# Altium schematic sheet comutator.SchDoc: =DocumentName
size A4; CompanyName: "AS Manufacturing" LLC; Organization: "AS Manufacturing" LLC; Address1: 5 Sklyarenka St.; Address2: Kyiv 04073; Address3: Ukraine; Address4: https://ajax.systems/en/; DocumentNumber: 4; SheetNumber: 4; SheetTotal: 7; Template_version: 1.0.1
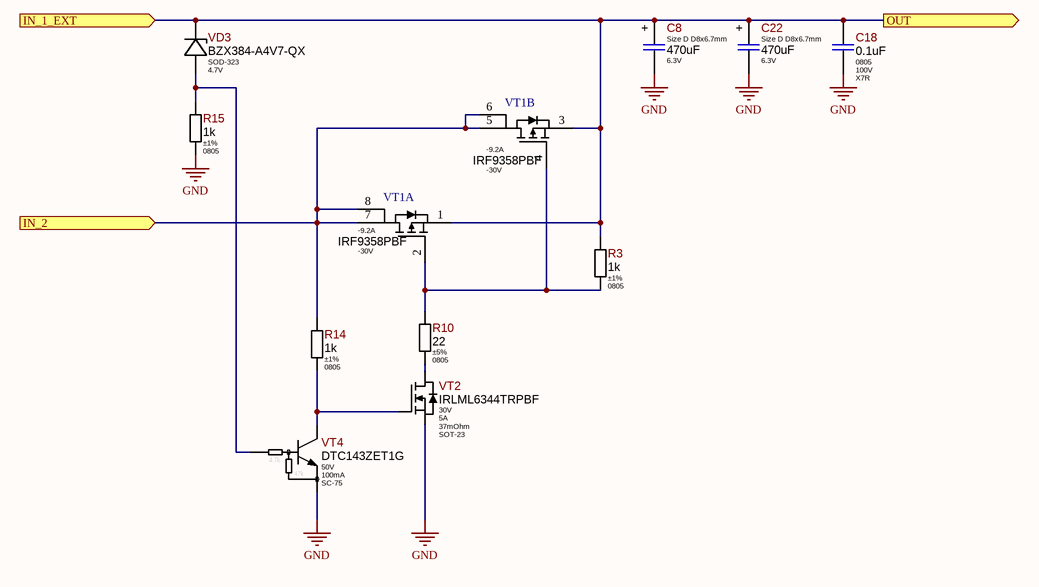
[diagram p0: comutator.SchDoc]

## Parts
C8  value 470uF  Package: Size D D8x6.7mm  Voltage: 6.3V  [CAP-AE-830x670H30_MED]  (hidden comment: 470uFx6.3V)
C18  Package: 0805  Voltage: 100V  Dielectric Type: X7R  [C_CERAMIC_0805_MED]  (hidden comment: 0.1uF)
C22  value 470uF  Package: Size D D8x6.7mm  Voltage: 6.3V  [CAP-AE-830x670H30_MED]  (hidden comment: 470uFx6.3V)
R3  Tolerance: ±1%  Package: 0805  [R_ANY_CHIP_0805_MED]  (hidden comment: 1k)
R10  Tolerance: ±5%  Package: 0805  [R_ANY_CHIP_0805_MED]  (hidden comment: 22)
R14  Tolerance: ±1%  Package: 0805  [R_ANY_CHIP_0805_MED]  (hidden comment: 1k)
R15  Tolerance: ±1%  Package: 0805  [R_ANY_CHIP_0805_MED]  (hidden comment: 1k)
VD3  Package: SOD-323  Voltage: 4.7V  [SOD-323_MED]  (hidden comment: BZX384-A4V7-QX)
VT1  Continuous Drain Current: -9.2A  Drain To Source Voltage: -30V  [FP-PG-DSO-8-IPC_B]  (hidden comment: IRF9358PBF)  (parts A,B of 2)
VT2  Vds: 30V  Id: 5A  Rds: 37mOhm  Package: SOT-23  [SOT-23_MED]  (hidden comment: IRLML6344)
VT4  Vce: 50V  Ic: 100mA  Package: SC-75  [SOT-416]  (hidden comment: DTC143ZET1G)

## Ports
IN_1_EXT (in), IN_2 (in), OUT (out)

## Nets
GND: C8.2 C18.2 C22.2 R15.2 VT2.2(S) VT4.2(E)
IN_1_EXT: C8.1 C18.1 C22.1 R3.1 VD3.CA VT1.1(S2) VT1.3(S1) ; port IN_1_EXT, port OUT
IN_2: R14.1 VT1.5(D12) VT1.6(D11) VT1.7(D22) VT1.8(D21) ; port IN_2
NetR3_2: R3.2 R10.1 VT1.2(G2) VT1.4(G1)
NetR10_2: R10.2 VT2.3(D)
NetR14_2: R14.2 VT2.1(G) VT4.3(C)
NetR15_1: R15.1 VD3.AN VT4.1(B)

## Notes on the sheet
- Title
- Product:
- Project:
- Size:
- Date:
- Variant:
- A4
- Authors:
- Time:
- Sheet
- of
- Revision:
- @Vitech_ua
- Commit:
- (in symbol DTC143ZET1G) 4.7k; 47k
- (in symbol RHA0J471MCN1GS) +

## Library data of the parts
C8 C22 = RHA0J471MCN1GS: 470uF 6.3V ±20% Size D D8x6.7mm SMD Low ESR Aluminum Electrolytic Capacitor, 9mOhm, 4.5A Ripple Current, 2000 Hrs @ 105°C; Manufacturer: Nichicon; Ajax_1C_ID: 47814; Ajax_1C_PN: 470uF 6.3V 20% 8x7.6mm RHA0J471MCN1GS Nichicon Aluminium Capacitors; Ajax_1С_Status: Mass Production; Standard Lead Time: 17 Weeks; Component Status: Released; Dielectric Type: NONE; GUID_1C: ebb9074e-17d1-11ed-a362-005056994834; Part Number: RHA0J471MCN1GS; Part Type: Aluminum; Component Type: SMD; Temperature Range: -55°C ~ 105°C; Tolerance: ±20%; ComponentLink1URL: https://eu.mouser.com/datasheet/2/293/e_rhs_rha-2507346.pdf; Supplier 1: Mouser; Supplier Part Number 1: 647-RHA0J471MCN1GS; Replacement: NONE; Price: 0,23717112; ComponentLink1Description: Datasheet
C18 = CL21B104KCFSFNE: 100nF 100V X7R ±10% 0805 Ceramic Capacitor RoHS; Manufacturer: Samsung Electro-Mechanics; Ajax_1C_ID: 12279; Ajax_1C_PN: 100nF 100V X7R 10% 0805 CL21B104KCFSFNE Ceramic Capacitor SMD RoHS; Ajax_1С_Status: Mass Production; Standard Lead Time: 22 Weeks; Component Status: Released; Replacement: NONE; GUID_1C: e54cb00c-325f-11e8-822c-14dda9d2d04d; Value: 0.1uF; Part Number: CL21B104KCFSFNE; Part Type: Ceramic / X7R / 0805; Component Type: SMD; Temperature Range: -55°C ~ 125°C; Tolerance: ±10%; ComponentLink1URL: https://media.digikey.com/pdf/Data%20Sheets/Samsung%20PDFs/CL_Series_MLCC_ds.pdf; Supplier 1: Digi-Key; Supplier Part Number 1: 1276-2923-2-ND; Price: 0,0054; ComponentLink1Description: Datasheet
R3 R14 R15 = RC0805FR-072K2L: 2.2 kOhms ±1% 1/8W 0805 Thick Film Resistor; Manufacturer: Yageo; Ajax_1C_ID: 30906; Ajax_1C_PN: 2.2k 1% 0805 Resistors SMD RoHS; Ajax_1С_Status: RND Only; Power Rating: 0.125W; Voltage: 150V; Component Status: Released; Temperature Stability: ±100ppm/°C; Replacement: NONE; GUID_1C: 690422a9-c9eb-11eb-ab74-0050569f2651; Value: 1k; Part Number: RC0805FR-072K2L; Component Type: SMD; Part Type: Thick Film; Temperature Range: -55°C ~ 155°C; ComponentLink1URL: https://eu.mouser.com/datasheet/2/447/YAGEO_PYu_RC_Group_51_RoHS_L_12-3313492.pdf; Supplier 1: Mouser; Supplier Part Number 1: 603-RC0805FR-072K2L; Price: 0.0014; ComponentLink1Description: Datasheet
R10 = RC0805JR-0722RL: 22 Ohms ±5%, 1/8W 0805 Thick Film Resistor; Manufacturer: Yageo; Ajax_1C_ID: 8822; Ajax_1C_PN: 22R 5% 0805 Resistors SMD RoHS; Ajax_1С_Status: Mass Production; Power Rating: 0.125W; Voltage: 150V; Component Status: Released; Temperature Stability: ±100ppm/°C; Replacement: NONE; GUID_1C: 3ba40fec-5951-11e6-81ec-d8cb8a9acc66; Value: 22; Part Number: RC0805JR-0722RL; Component Type: SMD; Part Type: Thick Film; Temperature Range: -55°C ~ 155°C; ComponentLink1URL: https://eu.mouser.com/datasheet/2/447/PYu_RC_Group_51_RoHS_L_10-1664068.pdf; Price: 0.0011; ComponentLink1Description: Datasheet
VD3 = BZX384-A4V7-QX: Zener Diode 4.7V, 300mW, ±1%, Leakage 3uA @ 2V, SOD-323; Manufacturer: Nexperia USA; Ajax_1C_PN: NONE; Ajax_1С_Status: RND Only; Marking: 22; Component Status: Released; Standard Lead Time: 4 Weeks; Part Number: BZX384-A4V7-QX; Part Type: Zener; Component Type: SMD; Temperature Range: -65°C ~ 150°C; ComponentLink1URL: https://eu.mouser.com/datasheet/2/916/BZX384_Q_SER-2721638.pdf; Supplier 1: Mouser; Supplier Part Number 1: 771-BZX384-A4V7-QX; Replacement: NONE; Price: NONE; ComponentLink1Description: Datasheet
VT1 = IRF9358PbF: MOSFET 2P-CH 30V 9.2A 8SOIC; Manufacturer: Infineon Technologies; Reverse Recovery Charge: 35nC; Gate Charge At Vgs: 19nC @ -4.5V; Max Forward Diode Voltage: -1.2V; Threshold Vgs Max: -2.4V; Turn Off Delay Time: 146ns; Threshold Vgs Min: -1.3V; Standoff Height: 0.1mm; Depletion Mode: False; Gate To Source Voltage: 20V; Input Capacitace At Vds: 1740pF @ -25V; Power Dissipation: 2W; Number Of P Channels: 2; Transconductance: 23S; Rthja Max: 62.5°C/W; Reverse Recovery Time: 55ns; Max Junction Temp: +150°C; Pulse Drain Current: -73A; Drain To Source Resistance: 19mΩ; Turn On Delay Time: 5.7ns; Mouser Description: Dual P-Channel 30 V 16.3 mOhm 19 nC HEXFET® Power Mosfet - SOIC-8; Footprint Url: https://www.infineon.com/dgdl/po-so8.pdf?fileId=5546d462580663ef0158068a1275014d; Temperature: -55°C to +150°C; Height: 1.75mm; Device Class L2: Transistors; ComponentLink2Description: Datasheet; ComponentLink2URL: https://www.infineon.com/dgdl/irf9358pbf.pdf?fileId=5546d462533600a4015356114ffa1da5; Ipc Land Pattern Name: SOIC127P600X155-8; Drain To Source Breakdown Voltage: -30V; Device Class L1: Discrete Semiconductors; Number Of Channels: 2; Automotive: No; Temperature Range High: +150°C; Temperature Range Low: -55°C; Device Class L3: MOSFETs; Octopart: https://octopart.com/irf9358pbf-infineon-65873752; Lead Free: Yes; Package: PG-DSO-8; Category: Trans; RoHS: TRUE; Digikey Description: MOSFET 2P-CH 30V 9.2A 8SOIC; Manufacturer Part Number: IRF9358PBF
VT2 = IRLML6344TRPBF: 30V, 5A max N-Channel HEXFET MOSFET, 29mOhm @ Vgs = 4.5V; Manufacturer: Infineon Technologies; Ajax_1C_ID: 9416; Ajax_1C_PN: IRLML6344TRPBF  SOT23. полевой транзистор; Ajax_1С_Status: RND Only; Component Status: Released; Standard Lead Time: 16 Weeks; Replacement: NONE; GUID_1C: 8299d48f-df0c-11e6-829c-d8cb8a9acc66; Part Number: IRLML6344TRPBF; Part Type: N-Channel; Component Type: SMD; Temperature Range: -55°C ~ 150°C; ComponentLink1URL: https://www.infineon.com/dgdl/irlml6344pbf.pdf?fileId=5546d462533600a4015356689c44262c; Supplier 1: Digi-Key; Supplier Part Number 1: IRLML6344TRPBFTR-ND; Price: 0.08596562; ComponentLink1Description: Datasheet
VT4 = DTC143ZET1G: 50V, 100mA Low Vce(sat) NPN Digital Transistor, Pre-Biased 4.7k/47k (with built-in resistors); Manufacturer: Onsemi; Ajax_1C_ID: 9410; Ajax_1C_PN: DTC143ZET1G SC-75-3  биполярный NPN транзистор; Ajax_1С_Status: Mass Production; Component Status: Released; Standard Lead Time: 8 Weeks; Replacement: NONE; GUID_1C: d76ac5d5-de69-11e6-829b-d8cb8a9acc66; Part Number: DTC143ZET1G; Part Type: NPN; Component Type: SMD; Temperature Range: -55°C ~ 150 °C; ComponentLink1URL: http://www.onsemi.com/pub/Collateral/DTC143Z-D.PDF; Supplier 1: Digi-Key; Supplier Part Number 1: DTC143ZET1GOSTR-ND; Price: 0.015; ComponentLink1Description: Datasheet